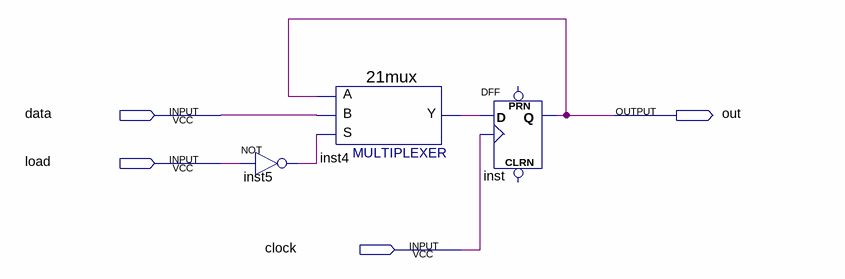
[diagram p0: schematic sheet]
// Quartus schematic Register1.bdf as structural Verilog: 3 symbols, 4 pins
module Register1 (
  input  data,
  input  load,
  input  clock,
  output out
);

  wire inst4_y, inst5_out;

  not inst5 (inst5_out, load);
  \21mux  inst4 (.S(inst5_out), .B(data), .A(out), .Y(inst4_y));
  DFF inst (.CLK(clock), .D(inst4_y), .Q(out));  // open: CLRN, PRN
endmodule
